# Altium schematic sheet ra01m.SchDoc
size A4; SheetNumber: 1; SheetTotal: 1
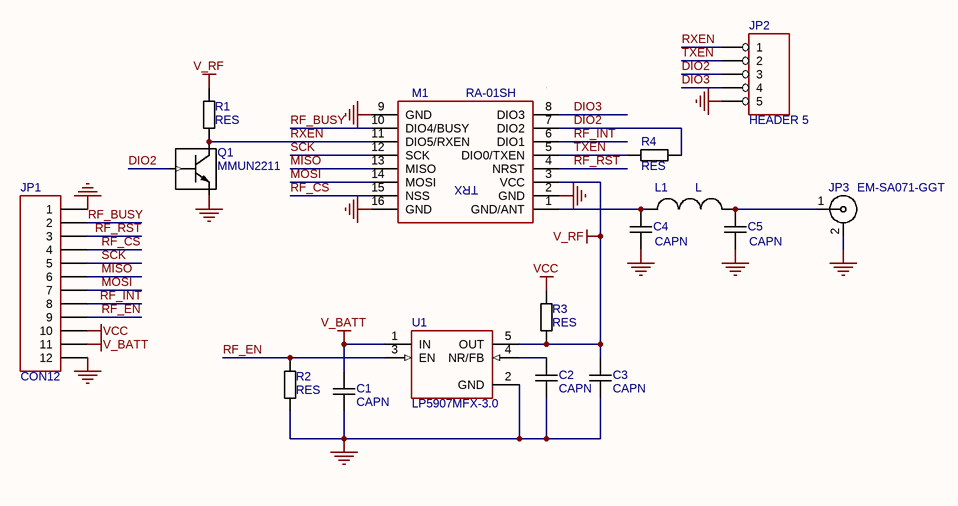
[diagram p0: ra01m.SchDoc]

## Parts
C1  CAPN  [C-0805]
C2  CAPN  [C-0603]
C3  CAPN  [C-0805]
C4  CAPN  [C-0603]
C5  CAPN  [C-0603]
JP1  CON12  [PBS1-12R]
JP2  HEADER 5  [PLS1-5]
JP3  EM-SA071-GGT  [SMA_F_EDGE]
L1  L  [L-0603]
M1  RA-01SH  [RA01]
Q1  MMUN2211  [SOT-23]
R1  RES  [R-0603]
R2  RES  [R-0603]
R3  RES  [R-0603]
R4  RES  [R-0603]
U1  LP5907MFX-3.0  [SOT-23-5]

## Nets
GND: C1.2 C2.2 C3.2 C4.2 C5.2 JP1.1 JP1.12 JP2.5 JP3.2 M1.2(GND) M1.9(GND) M1.16(GND) Q1.2(EMITTER) R2.1 U1.2(GND)
V_BATT: C1.1 JP1.11 U1.1(IN)
V_RF: C3.1 M1.3(VCC) R1.1 R3.1 U1.5(OUT)
VCC: JP1.10 R3.2
DIO2: JP2.3 M1.7(DIO2) Q1.1(BASE) R4.1
DIO3: JP2.4 M1.8(DIO3)
MISO: JP1.6 M1.13(MISO)
MOSI: JP1.7 M1.14(MOSI)
RF_BUSY: JP1.2 M1.10(DIO4/BUSY)
RF_CS: JP1.4 M1.15(NSS)
RF_EN: JP1.9 R2.2 U1.3(EN)
RF_INT: JP1.8 M1.6(DIO1)
RF_RST: JP1.3 M1.4(NRST)
RXEN: JP2.1 M1.11(DIO5/RXEN) Q1.3(COLLECTOR) R1.2
SCK: JP1.5 M1.12(SCK)
TXEN: JP2.2 M1.5(DIO0/TXEN) R4.2
NetC2_1: C2.1 U1.4(NR/FB)
NetC4_1: C4.1 L1.1 M1.1(GND/ANT)
NetC5_1: C5.1 JP3.1 L1.2

## Notes on the sheet
- (in symbol RA01_02_HT_RA_62) TRX

## Library data of the parts
C1-C5 = CAPN: Voltage: 50V; Точність/група: NP0; Вид: Конденсатор
JP1 = CON12: Connector; Вид: Роз'єм; *: *
JP2 = HEADER 5: Вид: Роз'єм; *: *
JP3 = SMA: SMA Female R/A PCB Mount; Вид: Роз'єм
L1 = L: Вид: Індуктивність
M1 = RA01_02_HT_RA_62
Q1 = MMUN2211: Вид: Транзистор
R1-R4 = RES: Точність/група: 5%; Вид: Резистор
U1 = LP5907: 250mA Low-Dropout Regulator; Вид: Мікросхема